# Altium schematic sheet Battery Voltage Detection.SchDoc
size A
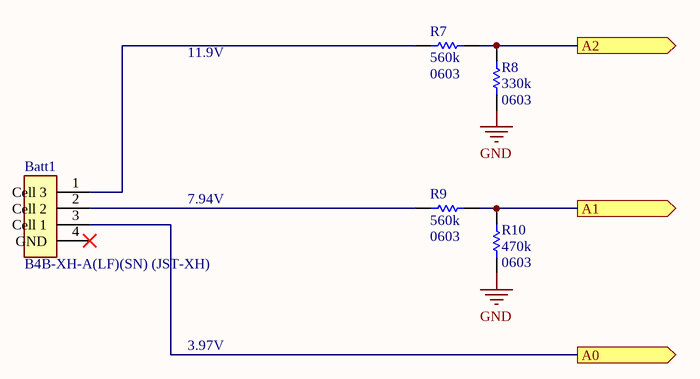
[diagram p0: Battery Voltage Detection.SchDoc]

## Parts
Batt1  B4B-XH-A(LF)(SN) (JST-XH)  [JST_B4B-XH-A(LF)(SN)]
R7  560k  value 0603  [SMD-0603-RES]
R8  330k  value 0603  [SMD-0603-RES]
R9  560k  value 0603  [SMD-0603-RES]
R10  470k  value 0603  [SMD-0603-RES]

## Ports
A0 (out), A1 (out), A2 (out)

## Nets
GND: R8.1 R10.1
A0: Batt1.3(Cell_1) ; port A0
A1: R9.1 R10.2 ; port A1
A2: R7.1 R8.2 ; port A2
NetBatt1_1: Batt1.1(Cell_3) R7.2
NetBatt1_2: Batt1.2(Cell_2) R9.2

Not connected (* = marked no-connect by the designer): Batt1 4(GND)*

## Notes on the sheet
- 11.9V
- 7.94V
- 3.97V

## Library data of the parts
Batt1 = B4B-XH-A(LF)(SN): Connector Header Through Hole 4 position 0.098 _2.50mm_; MP: B4B-XH-A_LF__SN_; MF: JST Sales; Price: None; Package: None; Value: *; Availability: Unavailable; SnapEDA_Link: https://www.snapeda.com/parts/B4B-XH-A%28LF%29%28SN%29/JST%20Sales%20America%20Inc./view-part/447494/?ref=snap
R7-R10 = Res1: Resistor; Published: 8-Jun-2000; LatestRevisionDate: 17-Jul-2002; LatestRevisionNote: Re-released for DXP Platform.; PackageReference: AXIAL-0.3; Publisher: Altium Limited; PackageDescription: Axial Device, Thru-Hole; 2 Leads; 0.3 in Pin Spacing